# EAGLE design project_2 (EAGLE 9.6.2)
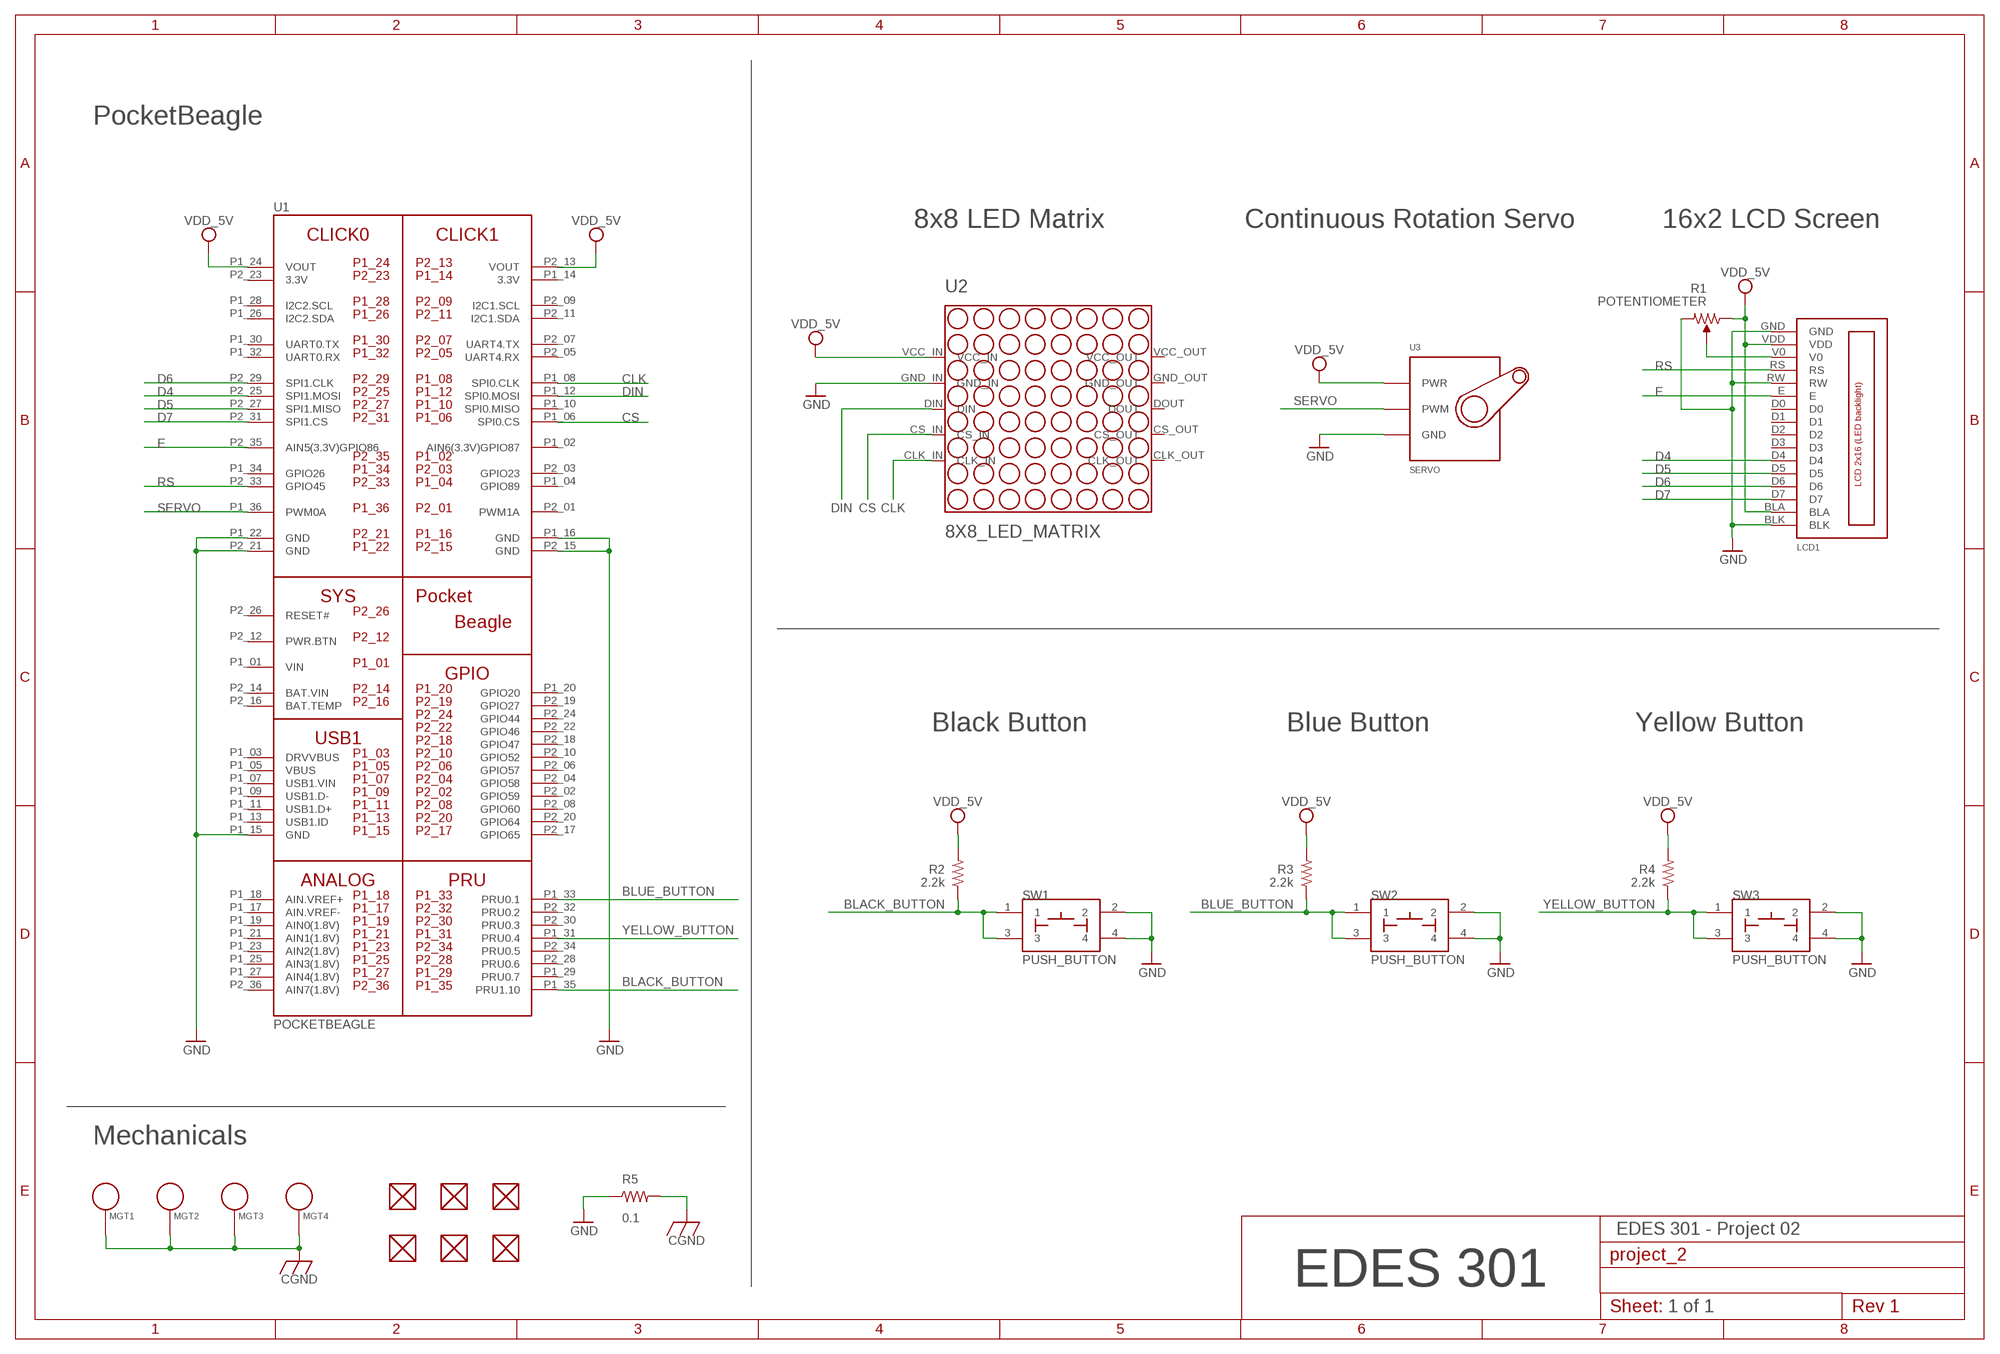
[diagram p0: schematic, sheet 1]

## Parts
FUD1  FIDUCIAL  [FIDUCIAL_40MIL]
FUD2  FIDUCIAL  [FIDUCIAL_40MIL]
FUD3  FIDUCIAL  [FIDUCIAL_40MIL]
FUD4  FIDUCIAL  [FIDUCIAL_40MIL]
FUD5  FIDUCIAL  [FIDUCIAL_40MIL]
FUD6  FIDUCIAL  [FIDUCIAL_40MIL]
LCD1  LCD_2X16_SIL  [HY-1602F]
MGT1  MOUNTING_HOLE  [MOUNTING_HOLE]
MGT2  MOUNTING_HOLE  [MOUNTING_HOLE]
MGT3  MOUNTING_HOLE  [MOUNTING_HOLE]
MGT4  MOUNTING_HOLE  [MOUNTING_HOLE]
R1  POTENTIOMETER  [POT-PO90S]
R2  2.2k  R_R0402  [R0402]
R3  2.2k  R_R0402  [R0402]
R4  2.2k  R_R0402  [R0402]
R5  0.1  R_R0805  [R0805]
SW1  PUSH_BUTTON  [BUTTON_12.5MM]
SW2  PUSH_BUTTON  [BUTTON_12.5MM]
SW3  PUSH_BUTTON  [BUTTON_12.5MM]
U1  POCKETBEAGLE  [POCKETBEAGLE]
U2  8X8_LED_MATRIX  [8X8_LED_MATRIX]
U3  SERVO  [SERVO-X1]

## Nets
BLACK_BUTTON: R2.1 SW1.1 SW1.3 U1.P1_35(PRU1.10)
BLUE_BUTTON: R3.1 SW2.1 SW2.3 U1.P1_33(PRU0.1)
CGND: MGT1.P$1 MGT2.P$1 MGT3.P$1 MGT4.P$1 R5.2
CLK: U1.P1_08(SPI0.CLK) U2.CLK_IN
CS: U1.P1_06(SPI0.CS) U2.CS_IN
D4: LCD1.D4 U1.P2_25(SPI1.MOSI)
D5: LCD1.D5 U1.P2_27(SPI1.MISO)
D6: LCD1.D6 U1.P2_29(SPI1.CLK)
D7: LCD1.D7 U1.P2_31(SPI1.CS)
DIN: U1.P1_12(SPI0.MOSI) U2.DIN
E: LCD1.E U1.P2_35(AIN5(3.3V)GPIO86)
GND: LCD1.BLK LCD1.GND LCD1.RW R1.CW R5.1 SW1.2 SW1.4 SW2.2 SW2.4 SW3.2 SW3.4 U1.P1_15(GND) U1.P1_16(GND) U1.P1_22(GND) U1.P2_15(GND) U1.P2_21(GND) U2.GND_IN U3.GND
RS: LCD1.RS U1.P2_33(GPIO45)
SERVO: U1.P1_36(PWM0A) U3.SIG(PWM)
V0: LCD1.V0 R1.S
VDD_5V: LCD1.BLA LCD1.VDD R1.CCW R2.2 R3.2 R4.2 U1.P1_24(VOUT) U1.P2_13(VOUT) U2.VCC_IN U3.PWR
YELLOW_BUTTON: R4.1 SW3.1 SW3.3 U1.P1_31(PRU0.4)
Unconnected: FUD1.P$1 FUD2.P$1 FUD3.P$1 FUD4.P$1 FUD5.P$1 FUD6.P$1 LCD1.D0 LCD1.D1 LCD1.D2 LCD1.D3 U1.P1_02(AIN6(3.3V)GPIO87) U1.P1_03(DRVVBUS) U1.P1_04(GPIO89) U1.P1_05(VBUS) U1.P1_07(USB1.VIN) U1.P1_09(USB1.D-) U1.P1_10(SPI0.MISO) U1.P1_11(USB1.D+) U1.P1_13(USB1.ID) U1.P1_17(AIN.VREF-) U1.P1_18(AIN.VREF+) U1.P1_19(AIN0(1.8V)) U1.P1_20(GPIO20) U1.P1_21(AIN1(1.8V)) U1.P1_23(AIN2(1.8V)) U1.P1_25(AIN3(1.8V)) U1.P1_26(I2C2.SDA) U1.P1_27(AIN4(1.8V)) U1.P1_28(I2C2.SCL) U1.P1_29(PRU0.7) U1.P1_30(UART0.TX) U1.P1_32(UART0.RX) U1.P1_34(GPIO26) U1.P2_01(PWM1A) U1.P2_02(GPIO59) U1.P2_03(GPIO23) U1.P2_04(GPIO58) U1.P2_05(UART4.RX) U1.P2_06(GPIO57) U1.P2_07(UART4.TX) U1.P2_08(GPIO60) U1.P2_09(I2C1.SCL) U1.P2_10(GPIO52) U1.P2_11(I2C1.SDA) U1.P2_12(PWR.BTN) U1.P2_16(BAT.TEMP) U1.P2_17(GPIO65) U1.P2_18(GPIO47) U1.P2_19(GPIO27) U1.P2_20(GPIO64) U1.P2_22(GPIO46) U1.P2_24(GPIO44) U1.P2_26(RESET#) U1.P2_28(PRU0.6) U1.P2_30(PRU0.3) U1.P2_32(PRU0.2) U1.P2_34(PRU0.5) U1.P2_36(AIN7(1.8V)) U2.CLK_OUT U2.CS_OUT U2.DOUT U2.GND_OUT U2.VCC_OUT

## Notes on the sheet
- PocketBeagle
- 8x8 LED Matrix | Continuous Rotation Servo | 16x2 LCD Screen
- Black Button | Blue Button | Yellow Button
- Mechanicals
- EDES 301 - Project 02
- EDES 301
- 1 of 1

## Power pins joined to a net without a drawn wire
3.3V: U1.P1_14(3.3V) U1.P2_23(3.3V)
BAT.VIN: U1.P2_14(BAT.VIN)
VIN: U1.P1_01(VIN)

## Library data of the parts
FUD1-FUD6 = combo_lock:FIDUCIAL
LCD1 = project_02:LCD_2X16_SIL
MGT1-MGT4 = combo_lock:MOUNTING_HOLE: Chassis Mounting Hole w/GND connection ability
R1 = project_02:POTENTIOMETER: Potentiometer - Examples: P090S-14T20BR10K (987-1277-ND)
R2-R4 = project_02:R_: RESISTOR, American symbol
R5 = combo_lock:R_: RESISTOR, American symbol
SW1-SW3 = project_02:PUSH_BUTTON
U1 = combo_lock:POCKETBEAGLE
U2 = project_02:8X8_LED_MATRIX
U3 = project_02:SERVO

## Board
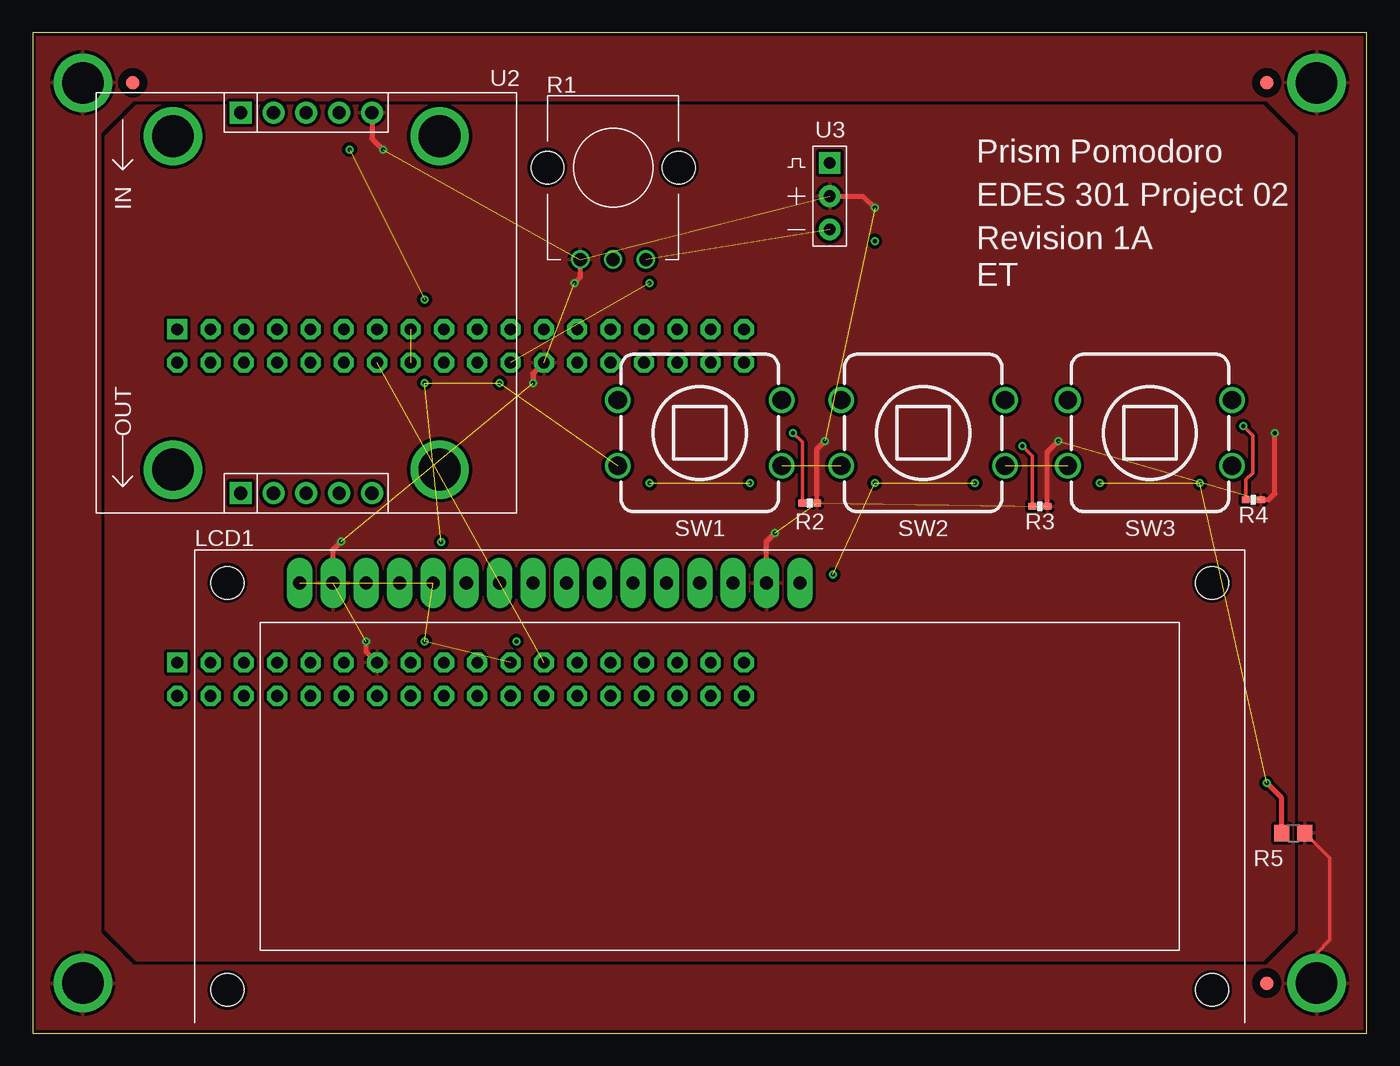
[diagram p1: board, top side]
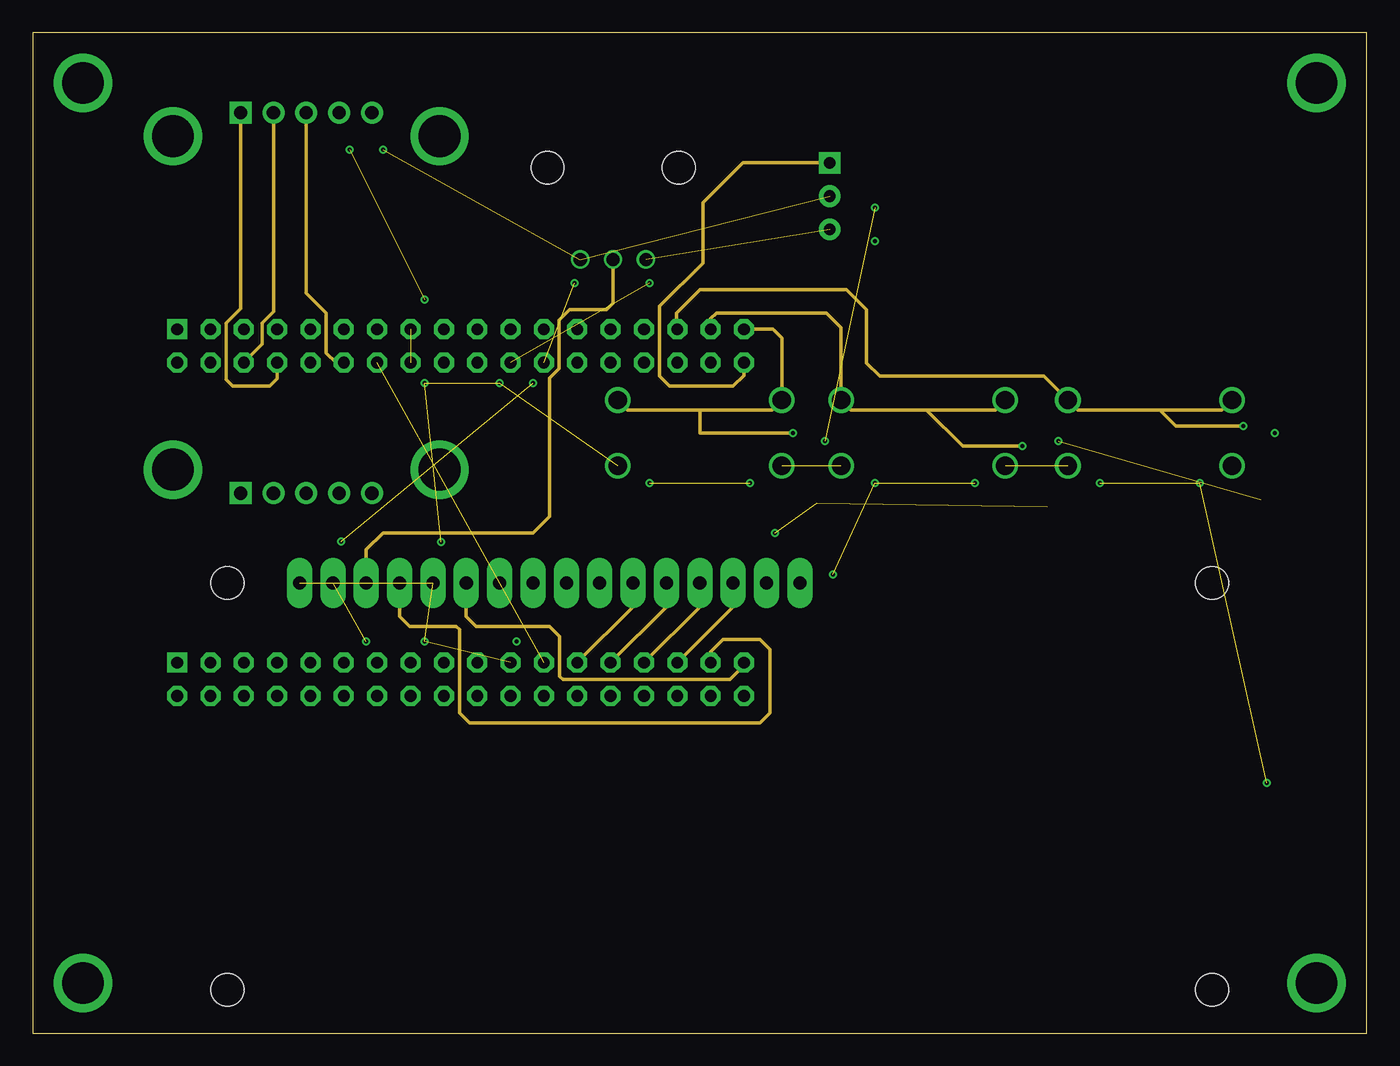
[diagram p2: board, inner layer Route2]
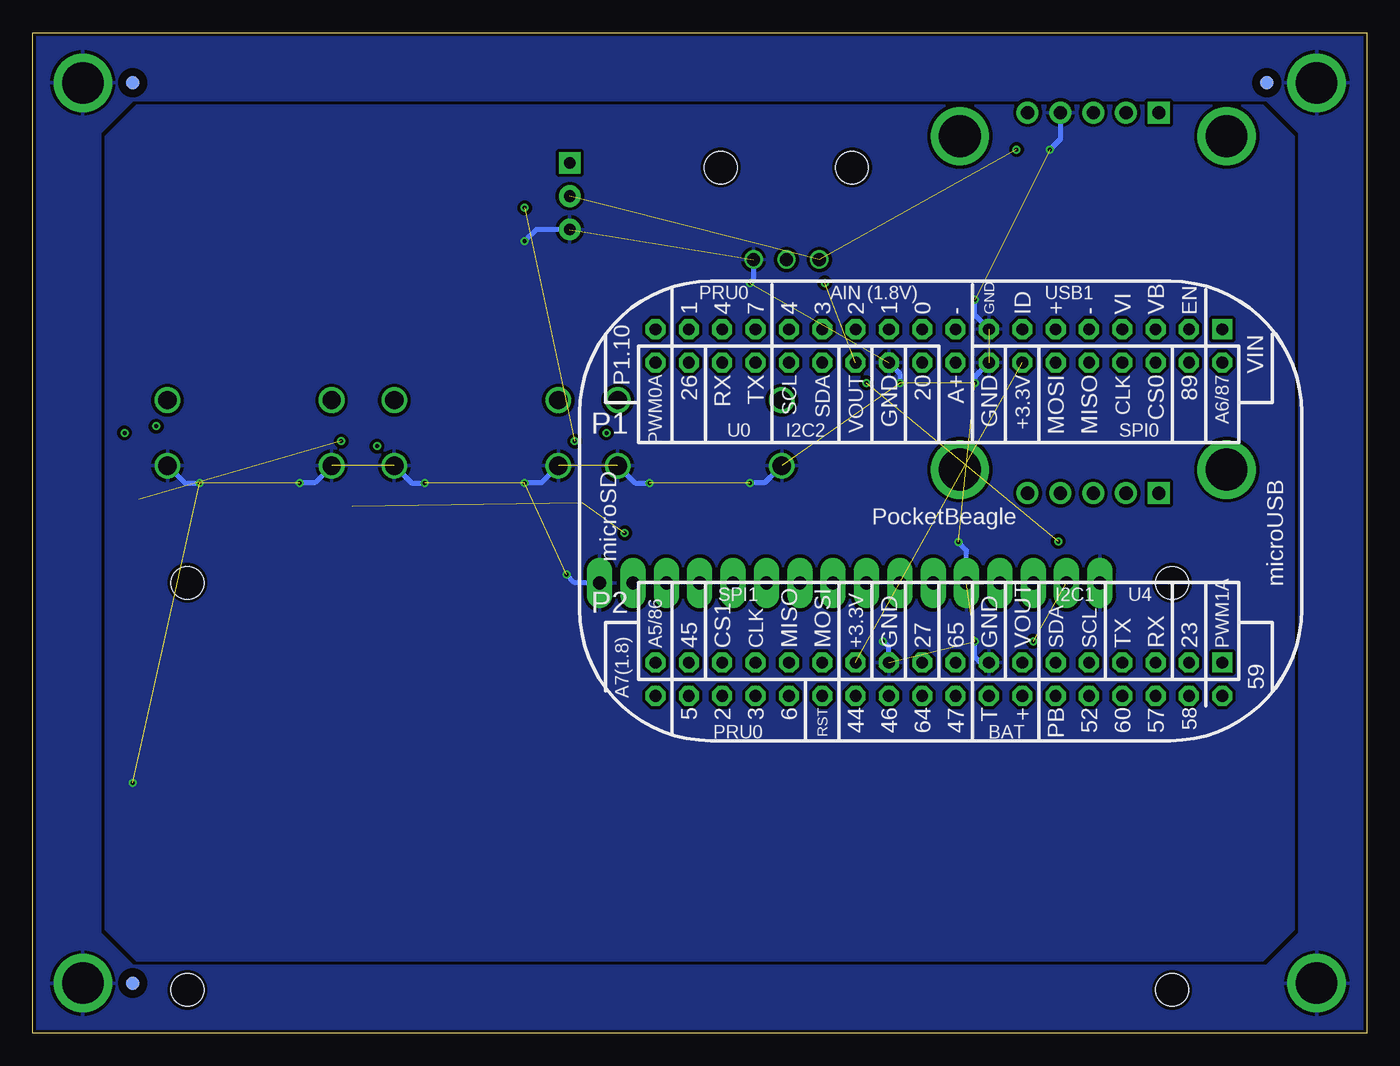
[diagram p3: board, bottom side, seen from below]

Size 101.6 x 76.2 mm. Coordinates in mm from the lower left corner, seen from the top.
Outline: 0,0 101.6,0 101.6,76.2 0,76.2 0,0
Copper layers (1*2*15*16): Top 0.035mm / dielectric 0.23mm / Route2 0.035mm / dielectric 0.93mm / Route15 0.035mm / dielectric 0.23mm / Bottom 0.035mm
Design rules "ENGI301_4lyr": minimum track width 10mil, minimum drill 12mil, track to track 10mil, track to pad 10mil, pad to pad 10mil, via to via 10mil, smd to smd 10mil, copper to edge 10mil, drill to drill 12mil, minimum pad ring 6mil, minimum via ring 6mil, stop-mask expansion 3mil, vias tented up to drill 25mil, thermal gap 10mil

### Footprints (pad centres in the part's own frame; a part is rotated, then mirrored left to right if it is on the bottom)
FIDUCIAL_40MIL = smd 1.016 x 1.016: P$1 0,0
HY-1602F = drill 1 pad 1.93 long: BLA 38.1,0; BLK 40.64,0; D0 17.78,0; D1 20.32,0; D2 22.86,0; D3 25.4,0; D4 27.94,0; D5 30.48,0; D6 33.02,0; D7 35.56,0; E 15.24,0; GND 2.54,0; RS 10.16,0; RW 12.7,0; V0 7.62,0; VDD 5.08,0 | hole 2.5: -2.96,0; 72.04,0; -2.96,-31; 72.04,-31
MOUNTING_HOLE = drill 3.175 pad 4.445: P$1 0,0
POT-PO90S = drill 1: CCW -2.5,0; CW 2.5,0; S 0,0 | hole 2.5: -5,7; 5,7
R0402 = smd 0.61 x 0.508: 1 -0.559,0; 2 0.559,0
R0805 = smd 1.143 x 1.27: 1 -0.889,0; 2 0.889,0
BUTTON_12.5MM = drill 1.4: 1 -6.25,2.5; 2 -6.25,-2.5; 3 6.25,2.5; 4 6.25,-2.5
POCKETBEAGLE = drill 0.889 pad 1.524 square: P1_01 5.91,3.53; P2_01 5.91,28.93 | drill 0.889 pad 1.524 octagon: P1_02 5.91,6.07; P1_03 8.45,3.53; P1_04 8.45,6.07; P1_05 10.99,3.53; P1_06 10.99,6.07; P1_07 13.53,3.53; P1_08 13.53,6.07; P1_09 16.07,3.53; P1_10 16.07,6.07; P1_11 18.61,3.53; P1_12 18.61,6.07; P1_13 21.15,3.53; P1_14 21.15,6.07; P1_15 23.69,3.53; P1_16 23.69,6.07; P1_17 26.23,3.53; P1_18 26.23,6.07; P1_19 28.77,3.53; P1_20 28.77,6.07; P1_21 31.31,3.53; P1_22 31.31,6.07; P1_23 33.85,3.53; P1_24 33.85,6.07; P1_25 36.39,3.53; P1_26 36.39,6.07; P1_27 38.93,3.53; P1_28 38.93,6.07; P1_29 41.47,3.53; P1_30 41.47,6.07; P1_31 44.01,3.53; P1_32 44.01,6.07; P1_33 46.55,3.53; P1_34 46.55,6.07; P1_35 49.09,3.53; P1_36 49.09,6.07; P2_02 5.91,31.47; P2_03 8.45,28.93; P2_04 8.45,31.47; P2_05 10.99,28.93; P2_06 10.99,31.47; P2_07 13.53,28.93; P2_08 13.53,31.47; P2_09 16.07,28.93; P2_10 16.07,31.47; P2_11 18.61,28.93; P2_12 18.61,31.47; P2_13 21.15,28.93; P2_14 21.15,31.47; P2_15 23.69,28.93; P2_16 23.69,31.47; P2_17 26.23,28.93; P2_18 26.23,31.47; P2_19 28.77,28.93; P2_20 28.77,31.47; P2_21 31.31,28.93; P2_22 31.31,31.47; P2_23 33.85,28.93; P2_24 33.85,31.47; P2_25 36.39,28.93; P2_26 36.39,31.47; P2_27 38.93,28.93; P2_28 38.93,31.47; P2_29 41.47,28.93; P2_30 41.47,31.47; P2_31 44.01,28.93; P2_32 44.01,31.47; P2_33 46.55,28.93; P2_34 46.55,31.47; P2_35 49.09,28.93; P2_36 49.09,31.47
8X8_LED_MATRIX = drill 1 pad 1.676 square: CLK_IN -14.5,-5; CLK_OUT 14.5,-5 | drill 1 pad 1.676: CS_IN -14.5,-2.5; CS_OUT 14.5,-2.5; DIN -14.5,0; DOUT 14.5,0; GND_IN -14.5,2.5; GND_OUT 14.5,2.5; VCC_IN -14.5,5; VCC_OUT 14.5,5 | drill 3.175 pad 4.445: P$1 -12.7,10.16; P$2 12.7,10.16; P$3 -12.7,-10.16; P$4 12.7,-10.16
SERVO-X1 = drill 0.889 pad 1.651: GND 0,-2.54; PWR 0,0 | drill 0.889 pad 1.651 square: SIG 0,2.54

### Placement (x,y rotation side)
FUD1  7.62,72.39 90 top
FUD2  93.98,72.39 90 top
FUD3  93.98,3.81 180 top
FUD4  7.62,72.39 0 bottom
FUD5  93.98,3.81 90 bottom
FUD6  93.98,72.39 90 bottom
LCD1  17.78,34.29 0 top
MGT1  3.81,72.39 90 top
MGT2  97.79,72.39 180 top
MGT3  3.81,3.81 90 top
MGT4  97.79,3.81 90 top
R1  44.2,58.93 0 top
R2  59.18,40.39 0 top
R3  76.71,40.13 0 top
R4  92.96,40.64 0 top
R5  96.01,15.24 0 top
SW1  50.8,45.72 0 top
SW2  67.82,45.72 0 top
SW3  85.09,45.72 0 top
U1  5.08,57.15 180 bottom
U2  20.83,55.63 270 top
U3  60.71,63.75 0 top

### Tracks (layer width: path | path; a pad name or v marks a point on that pad's centre or on a via)
3.3V  (1 unrouted)
BLACK_BUTTON  (via drill 0.3 pad 0.61)
  Top 0.254: v57.91,45.72 58.62,45.01 R2.1
  Route2 0.254: SW1.1 45.31,47.46 50.8,47.46 | 50.8,47.46 56.29,47.46 SW1.3 57.05,52.93 56.36,53.62 U1.P1_35 | 50.8,47.46 50.8,45.72 v57.91,45.72
BLUE_BUTTON  (via drill 0.3 pad 0.61)
  Top 0.254: v75.39,44.7 76.15,43.94 R3.1
  Route2 0.254: SW2.3 73.31,47.46 68.07,47.46 | 68.07,47.46 62.33,47.46 SW2.1 61.57,53.75 60.45,54.86 52.07,54.86 51.63,54.42 U1.P1_33 | 68.07,47.46 70.83,44.7 v75.39,44.7
CGND
  Top 0.254: MGT4.P$1 97.79,6.1 98.81,7.11 98.81,13.34 R5.2
  pour Top: -7.62,38.1 5.08,38.1 5.08,7.62 7.62,5.08 93.98,5.08 96.52,7.62 96.52,38.1 109.22,38.1 108.71,-7.62 -7.62,-7.62
  pour Top: -7.62,38.1 -7.62,83.82 109.22,83.82 109.22,38.1 96.52,38.1 96.52,68.58 93.98,71.12 7.62,71.12 5.08,68.58 5.08,38.1
  pour Bottom: -12.7,38.1 5.08,38.1 5.08,7.62 7.62,5.08 93.98,5.08 96.52,7.62 96.52,38.1 114.3,38.1 114.3,-10.16 -12.7,-10.16
  pour Bottom: 5.08,38.1 -12.7,38.1 -12.7,86.36 114.3,86.36 114.3,38.1 96.52,38.1 96.52,68.58 93.98,71.12 7.62,71.12 5.08,68.58
CLK
  Route2 0.254: U2.CLK_IN 15.83,55.2 14.73,54.1 14.73,49.78 15.24,49.28 18.03,49.28 18.61,49.85 U1.P1_08
CS
  Route2 0.254: U2.CS_IN 18.33,54.95 17.47,54.09 17.47,52.48 U1.P1_06
D4
  Route2 0.254: LCD1.D4 45.72,32.47 U1.P2_25
D5
  Route2 0.254: LCD1.D5 48.26,32.47 U1.P2_27
D6
  Route2 0.254: LCD1.D6 50.8,32.47 U1.P2_29
D7
  Route2 0.254: LCD1.D7 53.34,32.47 U1.P2_31
DIN
  Route2 0.254: U2.DIN 20.83,56.39 22.35,54.86 22.35,51.82 23.09,51.08 U1.P1_12
E
  Route2 0.254: LCD1.E 33.02,31.75 33.78,30.99 39.37,30.99 40.13,30.23 40.13,27.18 40.39,26.92 53.09,26.92 54.17,28.01 U1.P2_35
GND  (via drill 0.3 pad 0.61)  (17 unrouted)
  Top 0.381: R5.1 95.12,17.91 v93.98,19.05
  Bottom 0.381: U1.P2_15 29.41,28.22 29.84,28.66 v29.84,29.84 | U1.P2_21 36.39,29.41 v36.83,29.84 | LCD1.BLK 60.33,34.29 v60.96,34.92 | LCD1.RW 30.48,36.78 v31.11,37.41 | SW1.2 45.86,41.91 v46.99,41.91 | SW1.4 55.74,41.91 v54.61,41.91 | SW2.2 62.88,41.91 v64.14,41.91 | SW2.4 72.76,41.91 v71.75,41.91 | SW3.2 80.15,41.91 v81.28,41.91 | SW3.4 90.03,41.91 v88.9,41.91 | U1.P1_22 35.56,50.25 v35.56,49.53 | U1.P1_16 29.84,50.01 v29.84,49.53 | U1.P1_15 29.84,54.7 v29.84,55.88 | U2.GND_IN 23.33,68.11 v24.13,67.31 | R1.CW 46.7,57.44 v46.99,57.15 | U3.GND 63.25,61.21 v64.14,60.33
  pour Bottom (rank 6): -2.54,78.74 -2.54,-2.54 105.41,-2.54 105.41,78.74
RS
  Route2 0.254: LCD1.RS 27.94,31.75 28.7,30.99 32.26,30.99 32.51,30.73 32.51,24.38 33.27,23.62 55.37,23.62 56.13,24.38 56.13,29.21 55.37,29.97 52.58,29.97 51.63,29.02 U1.P2_33
SERVO
  Route2 0.254: U1.P1_36 54.17,50.11 53.34,49.28 48.51,49.28 47.75,50.04 47.75,55.37 51.05,58.67 51.05,63.25 54.1,66.29 U3.SIG
V0
  Route2 0.254: LCD1.V0 25.4,36.83 26.67,38.1 38.1,38.1 39.37,39.37 39.37,49.9 40.07,50.61 40.07,54.3 40.89,55.12 43.69,55.12 44.2,55.63 R1.S
VDD_5V  (via drill 0.3 pad 0.61)  (9 unrouted)
  Top 0.381: U1.P2_13 25.4,29.05 v25.4,29.84 | LCD1.BLA 55.88,37.47 v56.52,38.1 | LCD1.VDD 22.86,36.83 v23.5,37.47 | R2.2 59.74,44.5 v60.33,45.09 | R3.2 77.27,44.25 v78.11,45.09 | R4.2 94.16,40.64 94.61,41.1 v94.61,45.72 | U1.P1_24 38.1,50.25 v38.1,49.53 | U2.VCC_IN 25.83,68.15 v26.67,67.31 | R1.CCW 41.7,57.57 v41.27,57.15 | U3.PWR 63.25,63.75 v64.14,62.87
  pour Top (rank 6): -5.08,81.28 -5.08,-5.08 109.22,-5.08 109.22,81.28
YELLOW_BUTTON  (via drill 0.3 pad 0.61)
  Top 0.254: R4.1 92.41,42.16 92.91,42.67 92.91,45.52 v92.2,46.23
  Route2 0.254: SW3.3 90.58,47.46 85.85,47.46 | 85.85,47.46 79.6,47.46 SW3.1 77.02,50.04 64.52,50.04 63.5,51.05 63.5,55.12 61.98,56.64 50.8,56.64 49.02,54.86 49.02,53.69 U1.P1_31 | 85.85,47.46 87.08,46.23 v92.2,46.23

### Text on the board
tPlace: Prism Pomodoro | EDES 301 Project 02 | Revision 1A | ET